# Altium schematic sheet ShieldConnectors.SchDoc
size A4; SheetNumber: 4; SheetTotal: 4
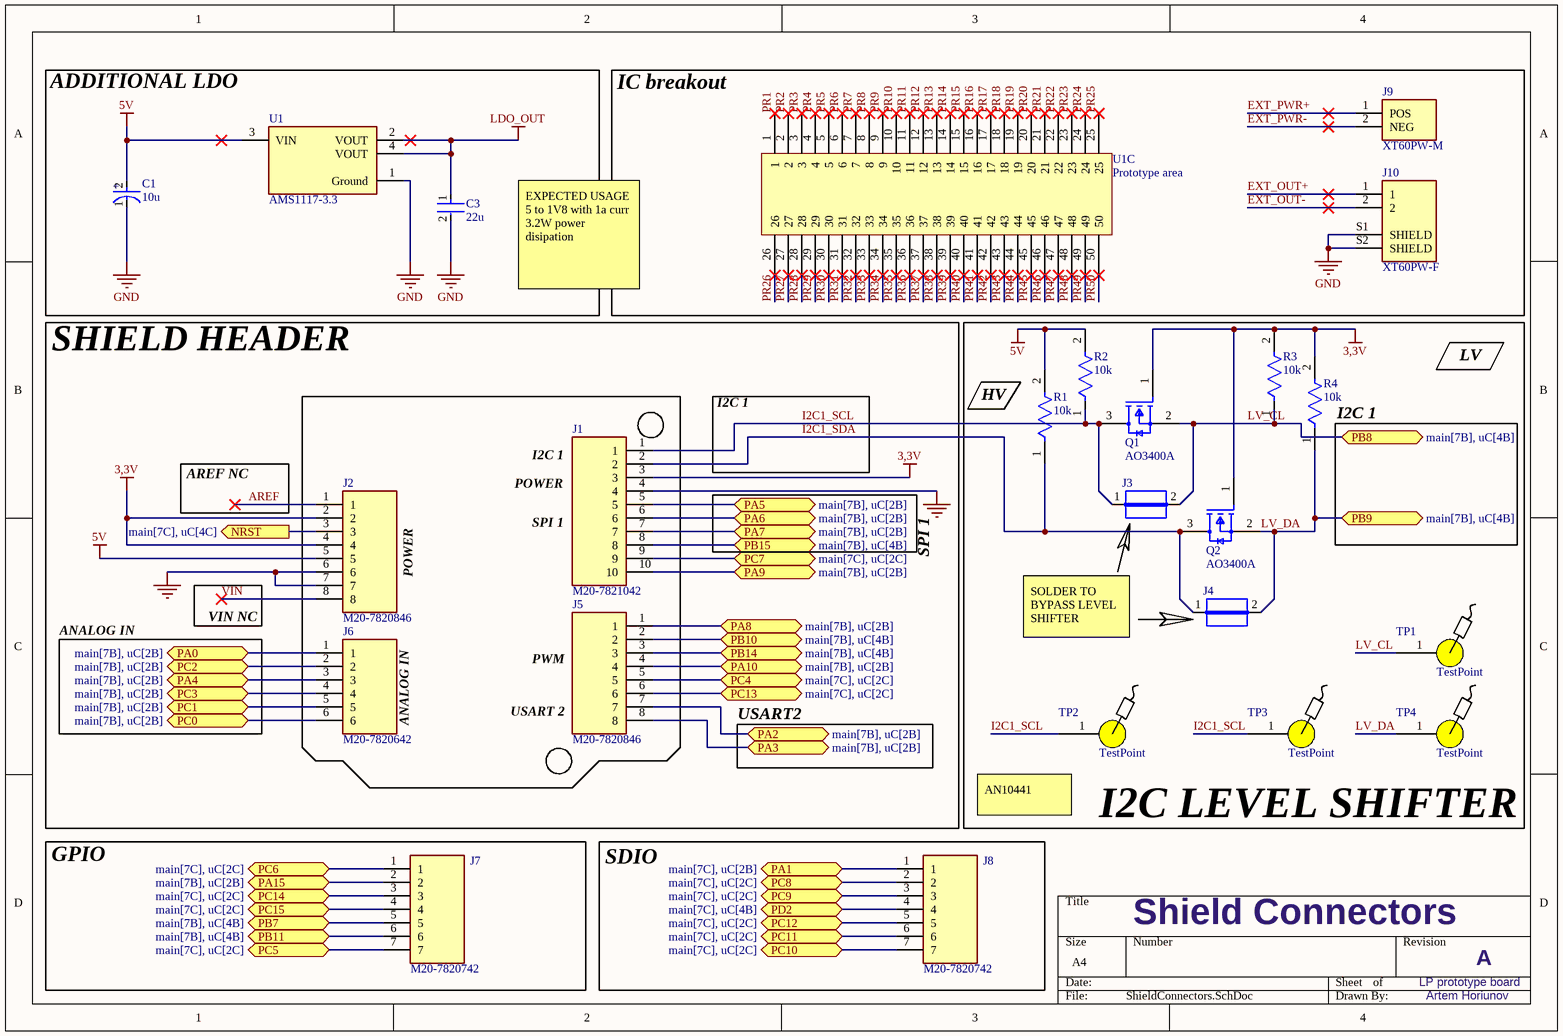
[diagram p0: ShieldConnectors.SchDoc]

## Parts
(Parts that share a designator on the sheet are numbered #1, #2 ... from top to bottom, then left to right.)
C1  10u  [FP-POSCAP-B2-MFG]
C3  22u  [FP-C3216-085-0_2-MFG]
J1  M20-7821042  [SHDR10W70P0X254_1X10_2580X250X865P]
J2  M20-7820846  [SHDR8W70P0X254_1X8_2072X250X865P]
J3  JUMPER  [JUMPER]  (value not drawn)
J4  JUMPER  [JUMPER]  (value not drawn)
J5  M20-7820846  [SHDR8W70P0X254_1X8_2072X250X865P]
J6  M20-7820642  [RHDR6W70P0X254_1X6_1564X250X865P]
J7  M20-7820742  [RHDR7W70P0X254_1X7_1818X250X865P]
J8  M20-7820742  [RHDR7W70P0X254_1X7_1818X250X865P]
J9  XT60PW-M  [AMASS_XT60PW-M]
J10  XT60PW-F  [AMASS_XT60PW-F]
Q1  AO3400A  [FP-SOT23-MFG]
Q2  AO3400A  [FP-SOT23-MFG]
R1  10k  [FP-RC0603-0_55-IPC_C]
R2  10k  [FP-RC0603-0_55-IPC_C]
R3  10k  [FP-RC0603-0_55-IPC_C]
R4  10k  [FP-RC0603-0_55-IPC_C]
TP1  TestPoint  [TestPoint]  (no BOM)
TP2  TestPoint  [TestPoint]  (no BOM)
TP3  TestPoint  [TestPoint]  (no BOM)
TP4  TestPoint  [TestPoint]  (no BOM)
U1#1  AMS1117-3.3  [FP-AMS1117-IPC_C]
U1#2  Prototype area  [SOP127P1030X265-50N]  (part C of 3)

## Blocks framed on the sheet
ADDITIONAL LDO: C1 C3 U1#1
IC breakout: J9 J10 U1#2
SHIELD HEADER: J1 J2 J5 J6
I2C LEVEL SHIFTER: J3 J4 Q1 Q2 R1-R4 TP1-TP4
GPIO: J7
SDIO: J8

## Ports
NRST (out, see main[7C], uC[4C]), PA0 (bidir, see main[7B], uC[2B]), PA1 (bidir, see main[7C], uC[2B]), PA2 (bidir, see main[7B], uC[2B]), PA3 (bidir, see main[7B], uC[2B]), PA4 (bidir, see main[7B], uC[2B]), PA5 (bidir, see main[7B], uC[2B]), PA6 (bidir, see main[7B], uC[2B]), PA7 (bidir, see main[7B], uC[2B]), PA8 (bidir, see main[7B], uC[2B]), PA9 (bidir, see main[7B], uC[2B]), PA10 (bidir, see main[7B], uC[2B]), PA15 (bidir, see main[7B], uC[2B]), PB7 (bidir, see main[7B], uC[4B]), PB8 (bidir, see main[7B], uC[4B]), PB9 (bidir, see main[7B], uC[4B]), PB10 (bidir, see main[7B], uC[4B]), PB11 (bidir, see main[7B], uC[4B]), PB14 (bidir, see main[7B], uC[4B]), PB15 (bidir, see main[7B], uC[4B]), PC0 (bidir, see main[7B], uC[2B]), PC1 (bidir, see main[7B], uC[2B]), PC2 (bidir, see main[7B], uC[2B]), PC3 (bidir, see main[7B], uC[2B]), PC4 (bidir, see main[7C], uC[2C]), PC5 (bidir, see main[7C], uC[2C]), PC6 (bidir, see main[7C], uC[2C]), PC7 (bidir, see main[7C], uC[2C]), PC8 (bidir, see main[7C], uC[2C]), PC9 (bidir, see main[7C], uC[2C]), PC10 (bidir, see main[7C], uC[2C]), PC11 (bidir, see main[7C], uC[2C]), PC12 (bidir, see main[7C], uC[2C]), PC13 (bidir, see main[7C], uC[2C]), PC14 (bidir, see main[7C], uC[2C]), PC15 (bidir, see main[7C], uC[2C]), PD2 (bidir, see main[7C], uC[4B])

## Nets
3,3V: J1.3 J2.2 J2.4 Q1.1(G) Q2.1(G) R3.2 R4.2
5V: C1.2(A) J2.5 R1.2 R2.2 U1#1.3(VIN)
GND: C1.1(C) C3.2 J1.4 J2.6 J2.7 J10.S1(SHIELD) J10.S2(SHIELD) U1#1.1(Ground)
LDO_OUT: C3.1 U1#1.2(VOUT) U1#1.4(VOUT)
AREF: J2.1
EXT_OUT+: J10.1
EXT_OUT-: J10.2
EXT_PWR+: J9.1(POS)
EXT_PWR-: J9.2(NEG)
I2C1_SCL: J1.1 J3.1 Q1.3(D) R2.1 TP2.1 TP3.1
I2C1_SDA: J1.2 J4.1 Q2.3(D) R1.1
LV_CL: J3.2 Q1.2(S) R3.1 TP1.1 ; port PB8
LV_DA: J4.2 Q2.2(S) R4.1 TP4.1 ; port PB9
NRST: J2.3 ; port NRST
PA0: J6.1 ; port PA0
PA1: J8.1 ; port PA1
PA2: J5.7 ; port PA2
PA3: J5.8 ; port PA3
PA4: J6.3 ; port PA4
PA5: J1.5 ; port PA5
PA6: J1.6 ; port PA6
PA7: J1.7 ; port PA7
PA8: J5.1 ; port PA8
PA9: J1.10 ; port PA9
PA10: J5.4 ; port PA10
PA15: J7.2 ; port PA15
PB7: J7.5 ; port PB7
PB10: J5.2 ; port PB10
PB11: J7.6 ; port PB11
PB14: J5.3 ; port PB14
PB15: J1.8 ; port PB15
PC0: J6.6 ; port PC0
PC1: J6.5 ; port PC1
PC2: J6.2 ; port PC2
PC3: J6.4 ; port PC3
PC4: J5.5 ; port PC4
PC5: J7.7 ; port PC5
PC6: J7.1 ; port PC6
PC7: J1.9 ; port PC7
PC8: J8.2 ; port PC8
PC9: J8.3 ; port PC9
PC10: J8.7 ; port PC10
PC11: J8.6 ; port PC11
PC12: J8.5 ; port PC12
PC13: J5.6 ; port PC13
PC14: J7.3 ; port PC14
PC15: J7.4 ; port PC15
PD2: J8.4 ; port PD2
PR1: U1#2.1
PR2: U1#2.2
PR3: U1#2.3
PR4: U1#2.4
PR5: U1#2.5
PR6: U1#2.6
PR7: U1#2.7
PR8: U1#2.8
PR9: U1#2.9
PR10: U1#2.10
PR11: U1#2.11
PR12: U1#2.12
PR13: U1#2.13
PR14: U1#2.14
PR15: U1#2.15
PR16: U1#2.16
PR17: U1#2.17
PR18: U1#2.18
PR19: U1#2.19
PR20: U1#2.20
PR21: U1#2.21
PR22: U1#2.22
PR23: U1#2.23
PR24: U1#2.24
PR25: U1#2.25
PR26: U1#2.26
PR27: U1#2.27
PR28: U1#2.28
PR29: U1#2.29
PR30: U1#2.30
PR31: U1#2.31
PR32: U1#2.32
PR33: U1#2.33
PR34: U1#2.34
PR35: U1#2.35
PR36: U1#2.36
PR37: U1#2.37
PR38: U1#2.38
PR39: U1#2.39
PR40: U1#2.40
PR41: U1#2.41
PR42: U1#2.42
PR43: U1#2.43
PR44: U1#2.44
PR45: U1#2.45
PR46: U1#2.46
PR47: U1#2.47
PR48: U1#2.48
PR49: U1#2.49
PR50: U1#2.50
VIN: J2.8

## Notes on the sheet
- EXPECTED USAGE 5 to 1V8 with 1a curr    3.2W power disipation
- LV
- I2C 1
- (near R1) HV
- (near R4) I2C 1
- AREF NC
- POWER
- SPI 1
- ANALOG IN
- VIN NC
- SOLDER TO BYPASS LEVEL SHIFTER
- USART 2
- PWM
- USART2
- AN10441
- Shield Connectors
- LP prototype board
- A
- Artem Horiunov
- (in symbol CMP-05428-001070-1) +

## Library data of the parts
C1 = CMP-05428-001070-1: Molded Tantalum Polymer Capacitor 10uF 20% 16V life 2000Hours SMD 1411; Leakage Current: 48uA; ESR (Equivalent Series Resistance): 100mR; Ripple Current: 800mA; Dissipation Factor: 10%; Polarity: Polar; Voltage Rating: 16V; REACH SVHC: No SVHC; Width: 2.8mm; Construction: Flat; Features: General Purpose; Life (Hours): 2000Hour; Radiation Hardening: No; Length: 3.5mm; Termination: SMD/SMT; Series: POSCAP™ TQC; Voltage Rating (DC): 16V; Mount: Surface Mount; Min Operating Temperature: -55°C; Lead Free: Lead Free; Tolerance: 20%; Number of Pins: 2; Case/Package: 1411; Case Code (Metric): 3528; Height: 1.9mm; Height - Seated (Max): 0.083inch; Package Quantity: 2000; Capacitance: 10uF; RoHS Compliant: Yes; Case Code (Imperial): 1210; Packaging: Tape and Reel; Voltage: 16V; Max Operating Temperature: 105°C; Depth: 2.8mm
C3 = CMP-08246-004858-1: Multilayer Ceramic Capacitors 22μF ±20% 6.3V X5R SMD 1206; Capacitance: 22uF; RoHS Compliant: Yes; Case/Package: 1206; Length: 0.126inch; Thickness: 0.037inch; Min Operating Temperature: -55°C; REACH SVHC: No SVHC; Number of Pins: 2; Weight: 0.000571oz; Resistor Type: Ceramic; Dielectric: X5R; Tolerance: 20%; Max Operating Temperature: 85°C; Package Quantity: 1; Series: C; Depth: 1.6mm; Width: 0.063inch; Lead Free: Lead Free; Dielectric Material: Ceramic; Case Code (Imperial): 1206; Mount: Surface Mount; Voltage Rating: 6.3V; Voltage Rating (DC): 6.3V; Case Code (Metric): 3216; Height: 0.85mm; Packaging: Cut Tape; Termination: SMD/SMT
J1 = M20-7821042: 2.54mm (0.1") Pitch SIL Vertical Throughboard Socket Assembly, selective gold + tin, 10 contacts; Manufacturer_Name: Harwin; Geometry.Height: 8.65mm; Manufacturer_Part_Number: M20-7821042; Mouser Part Number: 855-M20-7821042; Mouser Price/Stock: https://www.mouser.co.uk/ProductDetail/Harwin/M20-7821042?qs=Jph8NoUxIfUg6RlpQXBvqA%3D%3D; Arrow Part Number: *; Arrow Price/Stock: *; Datasheet Link: https://cdn.harwin.com/pdfs/M20-782.pdf
J2 J5 = M20-7820846: Headers & Wire Housings 8 PIN SIL VERTICAL SOCKET TIN; Manufacturer_Name: Harwin; Geometry.Height: 8.65mm; Manufacturer_Part_Number: M20-7820846; Mouser Part Number: 855-M20-7820846; Mouser Price/Stock: https://www.mouser.co.uk/ProductDetail/Harwin/M20-7820846?qs=WS5Jv%252B%252Bx1qVyh4iJa%252BIF%252BA%3D%3D; Arrow Part Number: *; Arrow Price/Stock: *; Datasheet Link: https://componentsearchengine.com/Datasheets/1/M20-7820846.pdf
J3 J4 = CMP-009-00061-2: Pins: 2
J6 = M20-7820642: HARWIN - M20-7820642 - Board-To-Board Connector, 2.54 mm, 6 Contacts, Receptacle, M20 Series, Through Hole, 1 Rows; Geometry.Height: 8.65mm; Manufacturer_Name: Harwin; Manufacturer_Part_Number: M20-7820642; Mouser Part Number: 855-M20-7820642; Mouser Price/Stock: https://www.mouser.co.uk/ProductDetail/Harwin/M20-7820642?qs=WS5Jv%252B%252Bx1qVj9bOS6VTo9g%3D%3D; Arrow Part Number: *; Arrow Price/Stock: *; Datasheet Link: https://cdn.harwin.com/pdfs/M20-782.pdf
J7 J8 = M20-7820742: Headers & Wire Housings 7 PIN SIL VERTICAL SOCKET GOLD+TIN; Manufacturer_Name: Harwin; Geometry.Height: 8.65mm; Manufacturer_Part_Number: M20-7820742; Mouser Part Number: 855-M20-7820742; Mouser Price/Stock: https://www.mouser.co.uk/ProductDetail/Harwin/M20-7820742?qs=vF78I%252BjhbY%252BKj4l6HUOnzg%3D%3D; Arrow Part Number: *; Arrow Price/Stock: *; Datasheet Link: https://cdn.harwin.com/pdfs/M20-782.pdf
J9 = CMP-002-00072-1: Socket, DC supply, male, PIN: 2; MF: AMASS; MP: XT60PW-M; Price: None; Component Type: Standard; Source: XT60PW-M.SchLib; SnapEDA_Link: https://www.snapeda.com/parts/XT60PW-M/AMASS/view-part/?ref=snap; Check_prices: https://www.snapeda.com/parts/XT60PW-M/AMASS/view-part/?ref=eda; Design Item ID: XT60PW-M; Value: *; Pins: 2; Availability: Not in stock; Case/Package: Package
J10 = CMP-002-00073-1: Socket DC Supply Connector Female; MF: AMASS; Source: XT60PW-F.SchLib; MP: XT60PW-F; Component Type: Standard; Case/Package: Package; Pins: 4; Value: *; Design Item ID: XT60PW-F; SnapEDA_Link: https://www.snapeda.com/parts/XT60PW-F/AMASS/view-part/?ref=snap; Availability: Not in stock; Price: None; Check_prices: https://www.snapeda.com/parts/XT60PW-F/AMASS/view-part/?ref=eda
Q1 Q2 = CMP-83955-000006-1: MOSFET N-CH 30V 5.7A SOT23; Input Capacitance: 630pF; Number of Elements: 1; Rds On Max: 26.5mR; Max Power Dissipation: 1.4W; Gate to Source Voltage (Vgs): 12V; Min Operating Temperature: -55°C; Lead Free: Lead Free; Number of Pins: 3; Drain to Source Voltage (Vdss): 30V; Case/Package: SOT-23; Mount: Surface Mount; Continuous Drain Current (ID): 5.7A; Radiation Hardening: No; Packaging: Tape and Reel; Max Operating Temperature: 150°C; Power Dissipation: 1.4W
R1-R4 = CMP-2100-03664-2: RES 10K OHM 1% 1/10W 0603; Voltage Rating: 75V; Voltage Rating (DC): 50V; Resistance: 10kR; Power Rating: 100mW; Temperature Coefficient: 100ppm/°C; Depth: 0.8mm; Termination: SMD/SMT; Resistor Type: Thick Film; Series: RC; Construction: Rectangular; Features: Moisture Resistant; Packaging: Tape and Reel; Min Operating Temperature: -55°C; Number of Terminations: 2; Lead Pitch: 0.3mm; RoHS Compliant: Yes; Case/Package: 0603; Resistance Tolerance: 1%; Military Standard: Not; Weight: 7.1E-05oz; Number of Pins: 2; Tolerance: 1%; Length: 1.6mm; Case Code (Imperial): 0603; Lead Free: Lead Free; Width: 0.8mm; Max Power Dissipation: 100mW; Height: 0.45mm; Max Operating Temperature: 155°C; Case Code (Metric): 1608; Size Code: 0603
U1#1 = CMP-209535-000001-1: LDO Voltage Regulators 1A, 3.3V; Manufacturer: Advanced Monolithic Systems; Dropout Voltage: 1.1V; Output Type: Fixed; Nominal Supply Current: 5mA; Max Power Dissipation: 1.2W; Max Supply Voltage: 15V; Number Of Outputs: 1; Standoff Height: 0.64mm; Max Junction Temp: +125°C; Height: 1.8mm; Package: AMS1117; Device Class L2: Power Management ICs; ComponentLink2Description: Datasheet; ComponentLink2URL: http://www.advanced-monolithic.com/pdf/ds1117.pdf; Category: IC; RoHS: TRUE; Automotive: No; Device Class L1: Integrated Circuits (ICs); Output Current: 1A; Device Class L3: Voltage Regulators - Linear; Temperature: -40°C to +125°C; Output Voltage: 3.3V; Manufacturer Part Number: AMS1117-3.3; Temperature Range Low: -40°C; Octopart: https://octopart.com/ams1117-3.3-advanced+monolithic+systems-25899300; Lead Free: Yes; Ipc Land Pattern Name: SOT229P700X180-4; Temperature Range High: +125°C
U1#2 = CMP-029-000000-1: Source: MEGA_IC.SchLib; Design Item ID: Component_1